# EAGLE design LM386 BOARD (EAGLE 7.1.0)
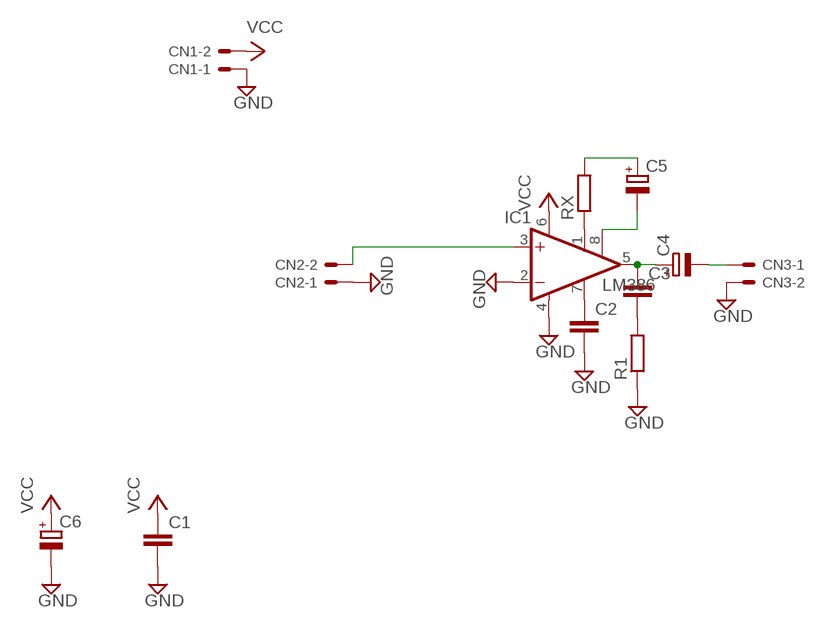
[diagram p0: schematic, sheet 1]

## Parts
C1  C-EUC0402K  [C0402K]
C2  C-EUC0402K  [C0402K]
C3  C-EUC0402K  [C0402K]
C4  CPOL-EU153CLV-0505  [153CLV-0505]
C5  CPOL-EU153CLV-0505  [153CLV-0505]
C6  CPOL-EU153CLV-0505  [153CLV-0505]
CN1  22-23-2021  [22-23-2021]
CN2  22-23-2021  [22-23-2021]
CN3  22-23-2021  [22-23-2021]
IC1  LM386  LM386M-1  [SO08]
R1  R-EU_R0805  [R0805]
RX  R-EU_R0805  [R0805]

## Nets
GND: C1.2 C2.2 C6.- CN1.1 CN2.1 CN3.2 IC1.2(-IN) IC1.4(GND) R1.1
N$1: CN2.2 IC1.3(+IN)
N$2: C5.- IC1.8(GAIN)
N$3: IC1.1(GAIN) RX.1
N$4: C5.+ RX.2
N$5: C2.1 IC1.7(BYPASS)
N$6: C3.1 C4.+ IC1.5(OUT)
N$7: C3.2 R1.2
N$8: C4.- CN3.1
VCC: C1.1 C6.+ CN1.2 IC1.6(VS)

## Library data of the parts
C1-C3 = rcl:C-EU: CAPACITOR, European symbol
C4-C6 = rcl:CPOL-EU: POLARIZED CAPACITOR, European symbol
CN1-CN3 = con-molex:22-23-2021: .100" (2.54mm) Center Header - 2 Pin; MF: MOLEX; MPN: 22-23-2021; OC_FARNELL: 1462926; OC_NEWARK: 25C3832
IC1 = linear:LM386?-*: Low Voltage Audio Power Amplifier Source: http://cache.national.com/ds/LM/LM386.pdf
R1 RX = rcl:R-EU_: RESISTOR, European symbol

## Board
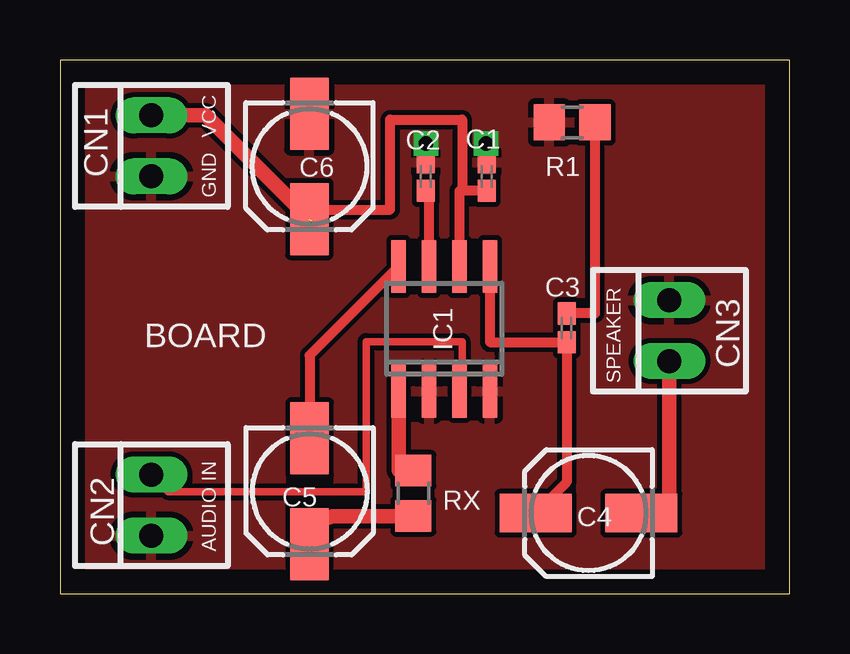
[diagram p1: board, top side]
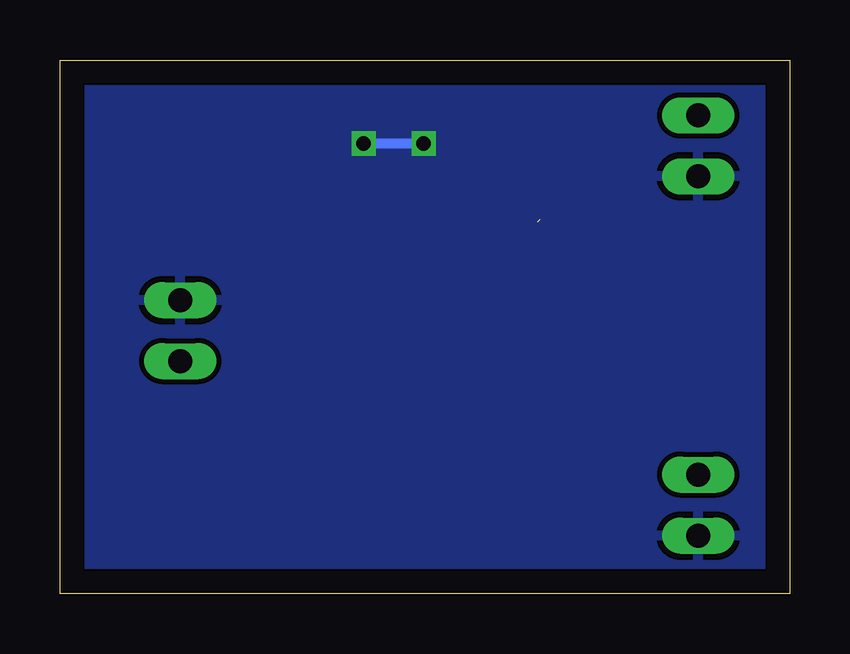
[diagram p2: board, bottom side, seen from below]

Size 30.4 x 22.23 mm. Coordinates in mm from the lower left corner, seen from the top.
Outline: 0,0 30.4,0 30.4,22.23 0,22.23 0,0
Copper layers (1*16): Top 0.035mm / dielectric 1.5mm / Bottom 0.035mm
Design rules "default": minimum track width 10mil, minimum drill 24mil, track to track 8mil, track to pad 8mil, pad to pad 8mil, via to via 8mil, smd to smd 8mil, copper to edge 40mil, drill to drill 8mil, minimum pad ring 10mil, minimum via ring 8mil, stop-mask expansion 4mil, vias tented up to drill 0mil, thermal gap 10mil

### Footprints (pad centres in the part's own frame; a part is rotated, then mirrored left to right if it is on the bottom)
C0402K = smd 0.925 x 0.74: 1 -0.6,0; 2 0.6,0
153CLV-0505 = smd 3 x 1.6: + 2.2,0; - -2.2,0
22-23-2021 = drill 1 long: 1 -1.27,0; 2 1.27,0
SO08 = smd 0.6 x 2.2: 1 -1.905,-2.6; 2 -0.635,-2.6; 3 0.635,-2.6; 4 1.905,-2.6; 5 1.905,2.6; 6 0.635,2.6; 7 -0.635,2.6; 8 -1.905,2.6
R0805 = smd 1.3 x 1.5: 1 -0.95,0; 2 0.95,0

### Placement (x,y rotation side)
C1  17.78,17.38 90 top
C2  15.24,17.38 90 top
C3  21.11,11.07 90 top
C4  22.02,3.35 180 top
C5  10.4,4.26 270 top
C6  10.39,17.8 270 top
CN1  3.81,18.65 90 top
CN2  3.81,3.68 90 top
CN3  25.39,10.95 90 top
IC1  16.01,11.03 0 top
R1  21.34,19.63 0 top
RX  14.72,4.18 270 top

### Tracks (layer width: path | path; a pad name or v marks a point on that pad's centre or on a via)
GND  (via drill 0.6)
  Top 0.406: C2.2 v15.25,18.75 | v17.75,18.75 17.78,18.75 C1.2
  Bottom 0.406: v15.25,18.75 v17.75,18.75
  pour Top: 0,22.5 30.5,22.5 30.5,0 0,0
  pour Bottom: 0,22.25 30.25,22.25 30.25,0 0,0
N$1
  Top 0.305: CN2.2 4.51,4.25 12.75,4.25 12.75,10.5 16.75,10.5 16.75,8.43 IC1.3
N$2
  Top 0.406: IC1.8 10.4,9.93 C5.-
N$3
  Top 0.61: RX.1 14.11,5.13 IC1.1
N$4
  Top 0.61: C5.+ arc-90 11.57,3.23 RX.2
N$5
  Top 0.406: IC1.7 15.38,16.78 C2.1
N$6
  Top 0.406: C4.+ 21.11,4.64 C3.1 17.91,10.47 IC1.5
N$7
  Top 0.406: R1.2 22.29,11.67 C3.2
N$8
  Top 0.61: CN3.1 25.39,3.35 C4.-
VCC  (1 unrouted)
  Top 0.406: C1.1 16.75,16.78 | IC1.6 16.64,16.78 16.75,16.78 | C6.+ 10.39,16 13.75,16 13.75,19.75 16.75,19.75 16.75,16.78
  Top 0.61: CN1.2 6.08,19.92 10.5,15.5

### Text on the board
tPlace: VCC | GND | SPEAKER | BOARD | AUDIO IN